# Altium schematic sheet Main.SchDoc
size A4; SheetNumber: 1; SheetTotal: 1
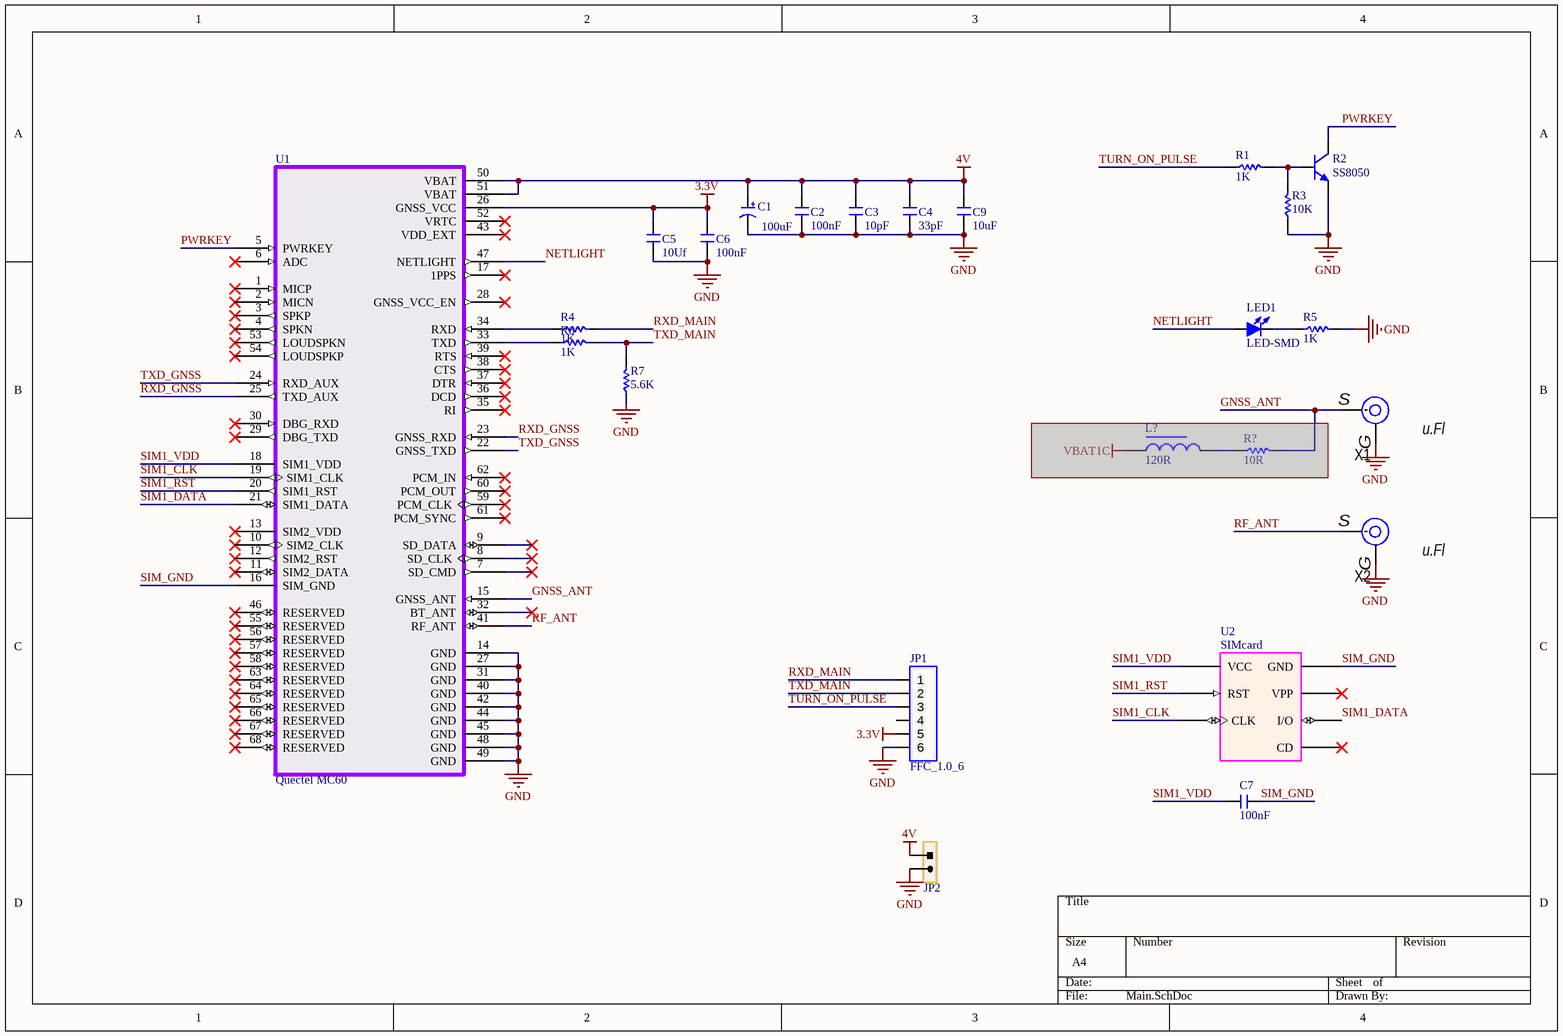
[diagram p0: Main.SchDoc]

## Parts
C1  100uF  [CD C(6032)]
C2  100nF  [C 0603]
C3  10pF  [C 0603]
C4  33pF  [C 0603]
C5  10Uf  [C 0603]
C6  100nF  [C 0603]
C7  100nF  [C 0603]
C9  10uF  [C 0603]
JP1  FFC_1.0_6  [FFC_1.0_6_BT]
JP2  HDR-1X2  [XH2.54-2P_H]  (value not drawn)
L?  120R  [L 0805]  (masked out: inside a compile mask, not in the netlist)
LED1  LED-SMD  [LED 0603Y]
R1  1K  [R 0603]
R2  SS8050  [SOT23-3N]
R3  10K  [R 0603]
R4  1K  [R 0603]
R5  1K  [R 0603]
R6  1K  [R 0603]
R7  5.6K  [R 0603]
R?  10R  [R 0805]  (masked out: inside a compile mask, not in the netlist)
U1  Quectel MC60  [Quectel MC60]
U2  SIMcard  [SIMcard_6pin_1]
X1  u.Fl  [u.Fl 3P]
X2  u.Fl  [u.Fl 3P]

## Nets
3.3V: C5.1 C6.1 JP1.5 U1.26(GNSS_VCC)
4V: C1.1(A) C2.1 C3.1 C4.1 C9.1 JP2.1 U1.50(VBAT) U1.51(VBAT)
GND: C1.2(K) C2.2 C3.2 C4.2 C5.2 C6.2 C9.2 JP1.6 JP2.2 R2.2(E) R3.1 R5.2 R7.1 U1.14(GND) U1.27(GND) U1.31(GND) U1.40(GND) U1.42(GND) U1.44(GND) U1.45(GND) U1.48(GND) U1.49(GND) X1.G(GND) X2.G(GND)
GNSS_ANT: U1.15(GNSS_ANT) X1.S(Signal)
NETLIGHT: LED1.1(A) U1.47(NETLIGHT)
PWRKEY: R2.3(C) U1.5(PWRKEY)
RF_ANT: U1.41(RF_ANT) X2.S(Signal)
RXD_GNSS: U1.23(GNSS_RXD) U1.25(TXD_AUX)
RXD_MAIN: JP1.1 R4.2
SIM1_CLK: U1.19(SIM1_CLK) U2.C3(CLK)
SIM1_DATA: U1.21(SIM1_DATA) U2.C7(I/O)
SIM1_RST: U1.20(SIM1_RST) U2.C2(RST)
SIM1_VDD: C7.1 U1.18(SIM1_VDD) U2.C1(VCC)
SIM_GND: C7.2 U1.16(SIM_GND) U2.C5(GND)
TURN_ON_PULSE: JP1.3 R1.1
TXD_GNSS: U1.22(GNSS_TXD) U1.24(RXD_AUX)
TXD_MAIN: JP1.2 R6.2 R7.2
NetLED1_2: LED1.2(K) R5.1
NetR1_2: R1.2 R2.1(B) R3.2
NetR4_1: R4.1 U1.34(RXD)
NetR6_1: R6.1 U1.33(TXD)

Not connected (* = marked no-connect by the designer): JP1 4; U1 1(MICP)* 2(MICN)* 3(SPKP)* 4(SPKN)* 6(ADC)* 7(SD_CMD)* 8(SD_CLK)* 9(SD_DATA)* 10(SIM2_CLK)* 11(SIM2_DATA)* 12(SIM2_RST)* 13(SIM2_VDD)* 17(1PPS)* 28(GNSS_VCC_EN)* 29(DBG_TXD)* 30(DBG_RXD)* 32(BT_ANT)* 35(RI)* 36(DCD)* 37(DTR)* 38(CTS)* 39(RTS)* 43(VDD_EXT)* 46(RESERVED)* 52(VRTC)* 53(LOUDSPKN)* 54(LOUDSPKP)* 55(RESERVED)* 56(RESERVED)* 57(RESERVED)* 58(RESERVED)* 59(PCM_CLK)* 60(PCM_OUT)* 61(PCM_SYNC)* 62(PCM_IN)* 63(RESERVED)* 64(RESERVED)* 65(RESERVED)* 66(RESERVED)* 67(RESERVED)* 68(RESERVED)*; U2 C6(VPP)* CD*

## Notes on the sheet
- (in symbol C-CD) +

## Library data of the parts
C1 = C-CD: Solid Tantalum Chip Capacitor, Standard T491 Series - Industrial Grade; Published: 17-Jul-2002; LatestRevisionDate: 19-Mar-2004; LatestRevisionNote: Silkscreen dimensions re-sized.; DatasheetDocument: Mar-2001; PackageDocument: Mar-2001; PackageReference: B; Publisher: Altium Limited; Code_JEITA: 3528-21; ComponentLink1Description: Manufacturer Link; ComponentLink1URL: http://www.kemet.com/; ComponentLink2Description: Datasheet; ComponentLink2URL: http://www.kemet.com/kemet/web/homepage/kechome.nsf/vapubfilesname/F3102TA.pdf/$file/F3102TA.pdf
C2-C7 C9 = C: Non-polar patch capacitor; BOM名称: 无极性贴片电容; 版权归属: 源创客; 学习资源: www.ooocke.com
JP1 = FFC_1.0_6: FFC
JP2 = Header 2: 2P Connector; BOM名称: 2P接插件; 版权归属: 源创客; 学习资源: www.ooocke.com
L? = L: Low power chip inductor; BOM名称: 小功率贴片电感; 版权归属: 源创客; 学习资源: www.ooocke.com
LED1 = LED-SMD: Patch LED; BOM名称: 贴片LED; 版权归属: 源创客; 学习资源: www.ooocke.com
R1 R3-R7 R? = R: Chip resistor; 版权归属: 源创客; BOM名称: Chip resistor; 学习资源: www.ooocke.com
R2 = 8050-SMD: High frequency amplification-NPN; BOM名称: 高频放大-NPN型; 版权归属: 源创客; 属性: 40V 1.5A 1W 100MHZ; 学习资源: www.ooocke.com
U1 = MC60: Ultra-small LCC Quad-band GSM/GPRS/GNSS Module
U2 = SIMcard (6pin)
X1 X2 = u.Fl 3P: RF; Manufacturer: Hirose Electric Co Ltd; Model: U.FL-R-SMT(01); HelpURL: *; ComponentKind: *